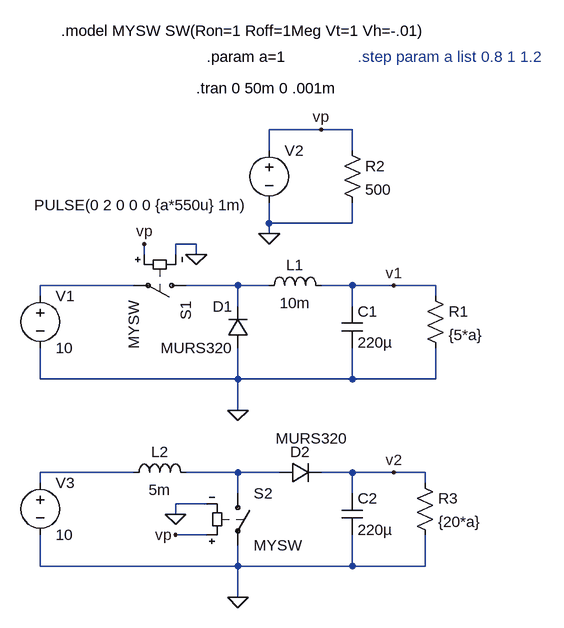
[diagram p0: schematic stepdown2.asc]
stepdown2.asc, the LTspice schematic file:
Version 4
SHEET 1 1260 756
WIRE 272 16 192 16
WIRE 320 16 272 16
WIRE 192 48 192 16
WIRE 320 48 320 16
WIRE 192 160 192 128
WIRE 320 160 320 128
WIRE 320 160 192 160
WIRE 192 176 192 160
WIRE 80 192 48 192
WIRE 0 208 0 192
WIRE 48 208 48 192
WIRE 80 208 80 192
WIRE -16 256 -160 256
WIRE 144 256 64 256
WIRE 192 256 144 256
WIRE 320 256 272 256
WIRE 384 256 320 256
WIRE 448 256 384 256
WIRE -160 272 -160 256
WIRE 448 272 448 256
WIRE 144 288 144 256
WIRE 320 288 320 256
WIRE -160 400 -160 352
WIRE 144 400 144 352
WIRE 144 400 -160 400
WIRE 320 400 320 352
WIRE 320 400 144 400
WIRE 448 400 448 352
WIRE 448 400 320 400
WIRE 144 448 144 400
WIRE -16 544 -160 544
WIRE 144 544 64 544
WIRE 208 544 144 544
WIRE 320 544 272 544
WIRE 384 544 320 544
WIRE 432 544 384 544
WIRE -160 560 -160 544
WIRE 432 560 432 544
WIRE 144 576 144 544
WIRE 320 576 320 544
WIRE 96 592 48 592
WIRE 48 608 48 592
WIRE 96 640 48 640
WIRE -160 688 -160 640
WIRE 144 688 144 656
WIRE 144 688 -160 688
WIRE 320 688 320 640
WIRE 320 688 144 688
WIRE 432 688 432 640
WIRE 432 688 320 688
WIRE 144 736 144 688
FLAG 144 448 0
FLAG 192 176 0
FLAG 80 208 0
FLAG 272 16 vp
FLAG 0 192 vp
FLAG 144 736 0
FLAG 48 608 0
FLAG 48 640 vp
FLAG 384 256 v1
FLAG 384 544 v2
SYMBOL diode 160 352 R180
WINDOW 0 24 64 Left 2
WINDOW 3 24 0 Left 2
SYMATTR InstName D1
SYMATTR Value MURS320
SYMBOL ind 176 272 R270
WINDOW 0 32 56 VTop 2
WINDOW 3 5 56 VBottom 2
SYMATTR InstName L1
SYMATTR Value 10m
SYMBOL cap 304 288 R0
SYMATTR InstName C1
SYMATTR Value 220µ
SYMBOL res 432 256 R0
SYMATTR InstName R1
SYMATTR Value {5*a}
SYMBOL voltage -160 256 R0
WINDOW 123 0 0 Left 2
WINDOW 39 0 0 Left 2
SYMATTR InstName V1
SYMATTR Value 10
SYMBOL voltage 192 32 R0
WINDOW 123 0 0 Left 2
WINDOW 39 0 0 Left 2
WINDOW 3 -361 100 Left 2
SYMATTR Value PULSE(0 2 0 0 0 {a*550u} 1m)
SYMATTR InstName V2
SYMBOL res 304 32 R0
SYMATTR InstName R2
SYMATTR Value 500
SYMBOL sw 80 256 R90
SYMATTR InstName S1
SYMATTR Value MYSW
SYMATTR SpiceLine 1
SYMBOL diode 208 560 R270
WINDOW 0 32 32 VTop 2
WINDOW 3 84 50 VBottom 2
SYMATTR InstName D2
SYMATTR Value MURS320
SYMBOL ind -32 560 R270
WINDOW 0 32 56 VTop 2
WINDOW 3 5 56 VBottom 2
SYMATTR InstName L2
SYMATTR Value 5m
SYMBOL cap 304 576 R0
SYMATTR InstName C2
SYMATTR Value 220µ
SYMBOL res 416 544 R0
SYMATTR InstName R3
SYMATTR Value {20*a}
SYMBOL voltage -160 544 R0
WINDOW 123 0 0 Left 2
WINDOW 39 0 0 Left 2
SYMATTR InstName V3
SYMATTR Value 10
SYMBOL sw 144 560 R0
SYMATTR InstName S2
SYMATTR Value MYSW
SYMATTR SpiceLine 1
TEXT 80 -48 Left 2 !.tran 0 50m 0 .001m
TEXT -128 -136 Left 2 !.model MYSW SW(Ron=1 Roff=1Meg Vt=1 Vh=-.01)
TEXT 96 -96 Left 2 !.param a=1
TEXT 328 -96 Left 2 ;.step param a list 0.8 1 1.2

The netlist it stands for:
* stepdown2.asc
D1 0 N002 MURS320
L1 N002 v1 10m
C1 v1 0 220µ
R1 v1 0 {5*a}
V1 N001 0 10
V2 vp 0 PULSE(0 2 0 0 0 {a*550u} 1m)
R2 vp 0 500
S1 N002 N001 vp 0 MYSW 1
D2 N004 v2 MURS320
L2 N003 N004 5m
C2 v2 0 220µ
R3 v2 0 {20*a}
V3 N003 0 10
S2 N004 0 vp 0 MYSW 1
.model D D
.lib standard.dio
.tran 0 50m 0 .001m
.model MYSW SW(Ron=1 Roff=1Meg Vt=1 Vh=-.01)
.param a=1
* .step param a list 0.8 1 1.2
.backanno
.end